# Altium schematic sheet Power.SchDoc
size A4; SheetNumber: 2; SheetTotal: 2
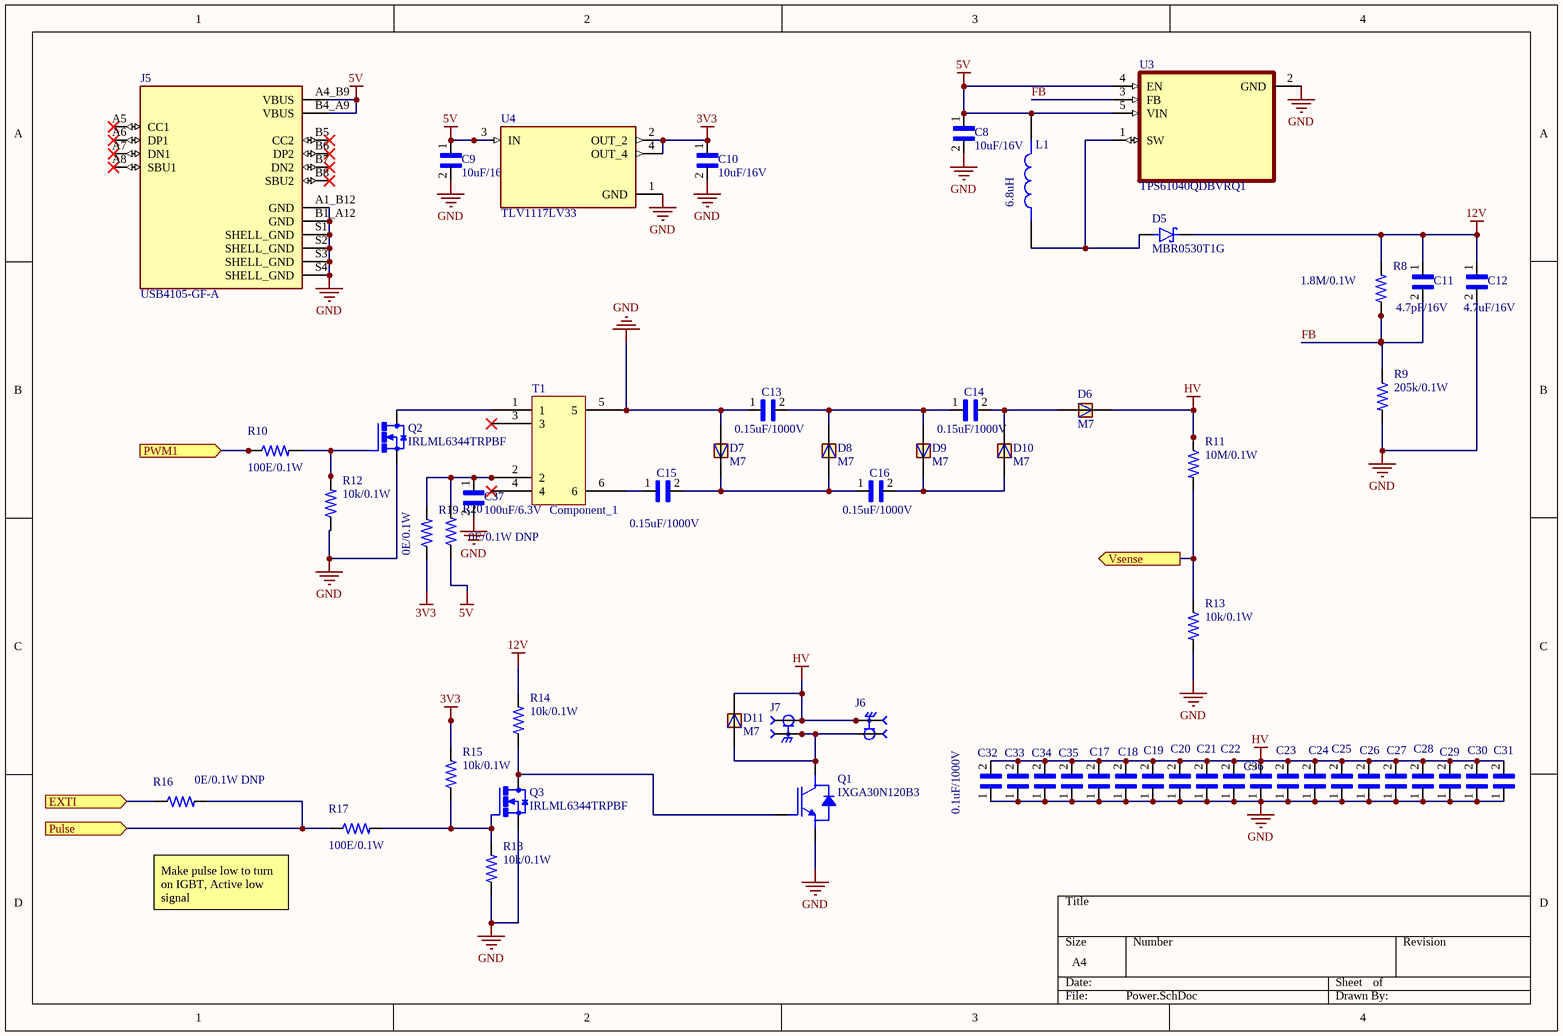
[diagram p0: Power.SchDoc]

## Parts
C8  10uF/16V  [CAPC1608X90]
C9  10uF/16V  [CAPC1608X90]
C10  10uF/16V  [CAPC1608X90]
C11  4.7pF/16V  [CAPC1608X90]
C12  4.7uF/16V  [CAPC1608X90]
C13  0.15uF/1000V  [CAPC5563X218N]
C14  0.15uF/1000V  [CAPC5563X218N]
C15  0.15uF/1000V  [CAPC5563X218N]
C16  0.15uF/1000V  [CAPC5563X218N]
C17  0.1uF/1000V  [CAPC4632X221N]  (value not drawn)
C18  0.1uF/1000V  [CAPC4632X221N]  (value not drawn)
C19  0.1uF/1000V  [CAPC4632X221N]  (value not drawn)
C20  0.1uF/1000V  [CAPC4632X221N]  (value not drawn)
C21  0.1uF/1000V  [CAPC4632X221N]  (value not drawn)
C22  0.1uF/1000V  [CAPC4632X221N]  (value not drawn)
C23  0.1uF/1000V  [CAPC4632X221N]  (value not drawn)
C24  0.1uF/1000V  [CAPC4632X221N]  (value not drawn)
C25  0.1uF/1000V  [CAPC4632X221N]  (value not drawn)
C26  0.1uF/1000V  [CAPC4632X221N]  (value not drawn)
C27  0.1uF/1000V  [CAPC4632X221N]  (value not drawn)
C28  0.1uF/1000V  [CAPC4632X221N]  (value not drawn)
C29  0.1uF/1000V  [CAPC4632X221N]  (value not drawn)
C30  0.1uF/1000V  [CAPC4632X221N]  (value not drawn)
C31  0.1uF/1000V  [CAPC4632X221N]  (value not drawn)
C32  0.1uF/1000V  [CAPC4632X221N]
C33  0.1uF/1000V  [CAPC4632X221N]  (value not drawn)
C34  0.1uF/1000V  [CAPC4632X221N]  (value not drawn)
C35  0.1uF/1000V  [CAPC4632X221N]  (value not drawn)
C36  0.1uF/1000V  [CAPC4632X221N]  (value not drawn)
C37  100uF/6.3V  [CAPC1608X90]
D5  MBR0530T1G  [SOD3715X145N]
D6  M7  [DIOM505270X240]
D7  M7  [DIOM505270X240]
D8  M7  [DIOM505270X240]
D9  M7  [DIOM505270X240]
D10  M7  [DIOM505270X240]
D11  M7  [DIOM505270X240]
J5  USB4105-GF-A  [GCT_USB4105-GF-A]
J6  SMA-J-P-X-ST-EM3  [SAMTEC_SMA-J-P-X-ST-EM3]  (value not drawn)
J7  SMA-J-P-X-ST-EM3  [SAMTEC_SMA-J-P-X-ST-EM3]  (value not drawn)
L1  6.8uH  [INDM3225X240N]
Q1  IXGA30N120B3  [TO254P1524X483-3N]
Q2  IRLML6344TRPBF  [SOT23]
Q3  IRLML6344TRPBF  [SOT23]
R8  1.8M/0.1W  [RESC1608X50N]
R9  205k/0.1W  [RESC1608X50N]
R10  100E/0.1W  [RESC1608X50N]
R11  10M/0.1W  [RESC1608X50N]
R12  10k/0.1W  [RESC1608X50N]
R13  10k/0.1W  [RESC1608X50N]
R14  10k/0.1W  [RESC1608X50N]
R15  10k/0.1W  [RESC1608X50N]
R16  0E/0.1W DNP  [RESC1608X50N]
R17  100E/0.1W  [RESC1608X50N]
R18  10k/0.1W  [RESC1608X50N]
R19  0E/0.1W  [RESC1608X50N]
R20  0E/0.1W DNP  [RESC1608X50N]
T1  Component_1  [PCBComponent_1]
U3  TPS61040QDBVRQ1  [SOT95P280X145-5N]
U4  TLV1117LV33  [VREG_TLV1117LV33DCYR]

## Ports
EXTI (in, see Controller[1C], Controller[3D]), Pulse (in, see Controller[2C]), PWM1 (in, see Controller[2C]), Vsense (out, see Controller[2C])

## Nets
3V3: C10.1 R15.2 R19.1 U4.2(OUT_2) U4.4(OUT_4)
5V: C8.1 C9.1 J5.A4_B9(VBUS) J5.B4_A9(VBUS) L1.2 R20.1 U3.4(EN) U3.5(VIN) U4.3(IN)
12V: C11.1 C12.1 D5.1(K) R8.2 R14.2
GND: C8.2 C9.2 C10.2 C12.2 C13.1 C17.1 C18.1 C19.1 C20.1 C21.1 C22.1 C23.1 C24.1 C25.1 C26.1 C27.1 C28.1 C29.1 C30.1 C31.1 C32.1 C33.1 C34.1 C35.1 C36.1 C37.2 D7.A J5.A1_B12(GND) J5.B1_A12(GND) J5.S1(SHELL_GND) J5.S2(SHELL_GND) J5.S3(SHELL_GND) J5.S4(SHELL_GND) Q1.3(E) Q2.2(S) Q3.2(S) R9.2 R12.1 R13.2 R18.1 T1.5 U3.2(GND) U4.1(GND)
HV: C17.2 C18.2 C19.2 C20.2 C21.2 C22.2 C23.2 C24.2 C25.2 C26.2 C27.2 C28.2 C29.2 C30.2 C31.2 C32.2 C33.2 C34.2 C35.2 C36.2 D6.C D11.C J6.2 J6.3 J7.1 R11.1
EXTI: R16.1 ; port EXTI
FB: C11.2 R8.1 R9.1 U3.3(FB)
Pulse: R16.2 R17.1 ; port Pulse
PWM1: R10.1 ; port PWM1
Vsense: R11.2 R13.1 ; port Vsense
NetC13_2: C13.2 C14.1 D8.C D9.A
NetC14_2: C14.2 D6.A D10.C
NetC15_1: C15.1 T1.6
NetC15_2: C15.2 C16.1 D7.C D8.A
NetC16_2: C16.2 D9.C D10.A
NetC37_1: C37.1 R19.2 R20.2 T1.2
NetD5_2: D5.2(A) L1.1 U3.1(SW)
NetD11_A: D11.A J6.1 J7.2 J7.3 Q1.2(C)
NetQ1_1: Q1.1(G) Q3.3(D) R14.1
NetQ2_1: Q2.1(G) R10.2 R12.2
NetQ2_3: Q2.3(D) T1.1
NetQ3_1: Q3.1(G) R15.1 R17.2 R18.2

Not connected (* = marked no-connect by the designer): J5 A5(CC1)* A6(DP1)* A7(DN1)* A8(SBU1)* B5(CC2)* B6(DP2)* B7(DN2)* B8(SBU2)*; T1 3* 4*

## Notes on the sheet
- Make pulse low to turn on IGBT, Active low signal

## Library data of the parts
C8-C12 C37 = CC0603MRX5R7BB106: CAP CER 10UF 16V X5R 0603; Package: None; Price: None; Value: *; MP: CC0603MRX5R7BB106; Availability: Unavailable
C13-C16 = VJ2225Y104KBGAT4X: Package: None; Price: None; Value: *; MP: VJ2225Y104KBGAT4X; Availability: Unavailable
C17-C36 = 1812CC104KAZ1A: 1812; MF: AVX; MP: 1812CC104KAZ1A; SnapEDA_Link: https://www.snapeda.com/parts/1812CC104KAZ1A/AVX/view-part/?ref=snap; Availability: In Stock; Package: 4632 AVX; Check_prices: https://www.snapeda.com/parts/1812CC104KAZ1A/AVX/view-part/?ref=eda; Value: *; Purchase-URL: https://pricing.snapeda.com/search/part/1812CC104KAZ1A/?ref=eda; Price: None
D5 = BAT46W-7-F: SOD-123; MF: Diodes Inc.; Package: SOD-123 Fairchild Semiconductor; Availability: In Stock; SnapEDA_Link: https://www.snapeda.com/parts/BAT46W-7-F/Diodes+Inc./view-part/?ref=snap; MP: BAT46W-7-F; Price: None; Check_prices: https://www.snapeda.com/parts/BAT46W-7-F/Diodes+Inc./view-part/?ref=eda; Value: *; Purchase-URL: https://pricing.snapeda.com/search/part/BAT46W-7-F/?ref=eda
D6-D11 = M7: Diode Standard 1000 V 1A Surface Mount DO-214AC (SMA); MF: Diotec Semiconductor; Price: None; Package: DO-214AC-2 Diotec; Purchase-URL: https://pricing.snapeda.com/search/part/M7/?ref=eda; Availability: In Stock; SnapEDA_Link: https://www.snapeda.com/parts/M7/Diotec/view-part/?ref=snap; Value: *; MP: M7; Check_prices: https://www.snapeda.com/parts/M7/Diotec/view-part/?ref=eda
J5 = USB4105-GF-A: USB-C (USB TYPE-C) USB 2.0 Receptacle Connector 24 (16+8 Dummy) Position Surface Mount, Right Angle; Through Hole; MF: GCT; Price: None; Availability: In Stock; MP: USB4105-GF-A; Package: None; SnapEDA_Link: https://www.snapeda.com/parts/USB4105-GF-A/Global+Connector+Technology/view-part/?ref=snap; Check_prices: https://www.snapeda.com/parts/USB4105-GF-A/Global+Connector+Technology/view-part/?ref=eda; Value: *; Purchase-URL: https://pricing.snapeda.com/search/part/USB4105-GF-A/?ref=eda
J6 J7 = SMA-J-P-X-ST-EM3: RF Connectors / Coaxial Connectors; MF: Samtec; Price: None; Package: None; Availability: Unavailable; Value: *; MP: SMA-J-P-X-ST-EM3
L1 = NLCV32T-6R8M-EFR: 1210; MF: TDK; Digi-Key_Part_Number: 445-16406-2-ND; Package: SMD-2 TDK; SnapEDA_Link: https://www.snapeda.com/parts/NLCV32T-6R8M-EFR/TDK/view-part/?ref=snap; Value: *; MP: NLCV32T-6R8M-EFR; Check_prices: https://www.snapeda.com/parts/NLCV32T-6R8M-EFR/TDK/view-part/?ref=eda; Purchase-URL: https://pricing.snapeda.com/search/part/NLCV32T-6R8M-EFR/?ref=eda
Q1 = ISL9V5045S3ST: TO-263-3; Package: None; Price: None; Value: *; MP: ISL9V5045S3ST; Availability: Unavailable
Q2 Q3 = MMBF170: SOT-23-3; MF: ON Semiconductor; Availability: Unavailable; Package: SOT-23 ON Semiconductor; SnapEDA_Link: https://www.snapeda.com/parts/MMBF170/ON%20Semiconductor/view-part/1400962/?ref=snap; MP: MMBF170; Price: None; Value: *
R8-R20 = 3-1879460-5: RES 0.27 OHM 1% 1/10W 0603; MF: TE Connectivity; Power_Rating: .1 W; Resistance: 27; Value: *; Check_prices: https://www.snapeda.com/parts/3-1879460-5/TE+Connectivity/view-part/?ref=eda; Availability: In Stock; Package: 0603; Tolerance: 1%; SnapEDA_Link: https://www.snapeda.com/parts/3-1879460-5/TE+Connectivity/view-part/?ref=snap; Price: None; EU_RoHS_Compliance: Compliant with Exemptions; MP: 3-1879460-5
U4 = TLV1117LV33DCYR: 1-A, low-dropout voltage regulator; MF: Texas Instruments; Check_prices: https://www.snapeda.com/parts/TLV1117LV33DCYR/Texas+Instruments/view-part/?ref=eda; Value: *; MP: TLV1117LV33DCYR; Purchase-URL: https://pricing.snapeda.com/search/part/TLV1117LV33DCYR/?ref=eda; SnapEDA_Link: https://www.snapeda.com/parts/TLV1117LV33DCYR/Texas+Instruments/view-part/?ref=snap; Package: SOT-223-4 Texas Instruments; Digi-Key_Part_Number: 296-28778-2-ND
U3 = TPS61040QDBVRQ1: Package: None; Price: None; Value: *; MP: TPS61040QDBVRQ1; Availability: Unavailable